# Altium schematic sheet CurrentSenseAmp.SchDoc
size A; SheetNumber: 7; SheetTotal: 8
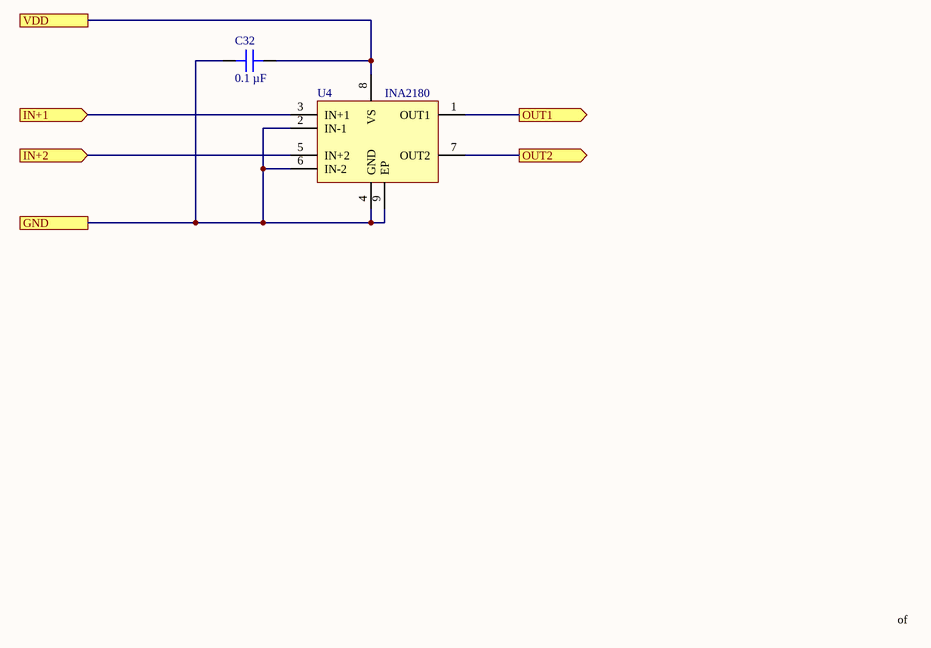
[diagram p0: CurrentSenseAmp.SchDoc]

## Parts
C32  0.1 µF  [CAP 0201_0603]
U4  INA2180  [WSON-8_2x2]

## Ports
GND, IN+1 (in), IN+2 (in), OUT1 (out), OUT2 (out), VDD

## Nets
GND: C32.1 U4.2(IN-1) U4.4(GND) U4.6(IN-2) U4.9(EP) ; port GND
IN+1: U4.3(IN+1) ; port IN+1
IN+2: U4.5(IN+2) ; port IN+2
OUT1: U4.1(OUT1) ; port OUT1
OUT2: U4.7(OUT2) ; port OUT2
VDD: C32.2 U4.8(VS) ; port VDD

## Notes on the sheet
- of

## Library data of the parts
C32 = GRT033R6YA104KE01D: CAP CER 0.1UF 35V X5R 0201; manufacturer: Murata Electronics; Tolerance: ±10%; Part Number: GRT033R6YA104KE01D; Value: 0.1 µF; Applications: Automotive; Capacitance: 0.1 µF; componentlink1description: Datasheet; componentlink1url: https://search.murata.co.jp/Ceramy/image/img/A01X/G101/ENG/GRT033R6YA104KE01-01.pdf; componentlink2description: DigiKey Link; componentlink2url: https://www.digikey.com/en/products/detail/murata-electronics/GRT033R6YA104KE01D/10694796; Device Package: 0201 (0603 Metric); lastupdated: 7/15/2023 7:00:43 PM; Lifecycle Status: Active; Minimum Order: 1; Mounting Type: Surface Mount, MLCC; Operating Temperature: -55°C ~ 85°C; Package / Case: 0201 (0603 Metric); packaging: TapeAndReel; partid: 49925; Part Status: Active; price: 0.01; Ratings: AEC-Q200; series: GRT; Size / Dimension: 0.024" L x 0.012" W (0.60mm x 0.30mm); Supplier 1: DigiKey; Supplier Part Number 1: 490-GRT033R6YA104KE01DCT-ND; Temperature Coefficient: X5R; Thickness (Max): 0.013" (0.33mm); Voltage - Rated: 35V
U4 = INA2180: Current sense amplifier 4 channel